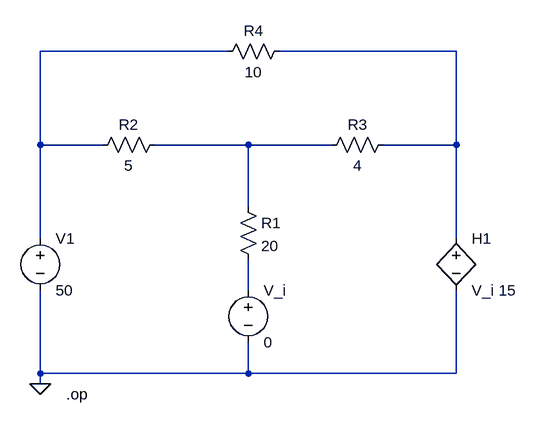
[diagram p0: schematic CH03-KP2-01.asc]
CH03-KP2-01.asc, the LTspice schematic file:
Version 4
SHEET 1 880 680
WIRE 192 112 -96 112
WIRE 544 112 272 112
WIRE -96 256 -96 112
WIRE 0 256 -96 256
WIRE 224 256 80 256
WIRE 352 256 224 256
WIRE 544 256 544 112
WIRE 544 256 432 256
WIRE 224 352 224 256
WIRE -96 400 -96 256
WIRE 544 400 544 256
WIRE 224 480 224 432
WIRE -96 608 -96 480
WIRE 224 608 224 560
WIRE 224 608 -96 608
WIRE 544 608 544 480
WIRE 544 608 224 608
WIRE -96 624 -96 608
FLAG -96 624 0
DATAFLAG 256 256 "$"
SYMBOL res 208 336 R0
SYMATTR InstName R1
SYMATTR Value 20
SYMBOL res 96 240 R90
WINDOW 0 0 56 VBottom 2
WINDOW 3 32 56 VTop 2
SYMATTR InstName R2
SYMATTR Value 5
SYMBOL res 448 240 R90
WINDOW 0 0 56 VBottom 2
WINDOW 3 32 56 VTop 2
SYMATTR InstName R3
SYMATTR Value 4
SYMBOL res 288 96 R90
WINDOW 0 0 56 VBottom 2
WINDOW 3 32 56 VTop 2
SYMATTR InstName R4
SYMATTR Value 10
SYMBOL voltage -96 384 R0
SYMATTR InstName V1
SYMATTR Value 50
SYMBOL voltage 224 464 R0
SYMATTR InstName V_i
SYMATTR Value 0
SYMBOL h 544 384 R0
SYMATTR InstName H1
SYMATTR Value V_i 15
TEXT -56 640 Left 2 !.op

The netlist it stands for:
* CH03-KP2-01.asc
R1 N003 N004 20
R2 N003 N001 5
R3 N002 N003 4
R4 N002 N001 10
V1 N001 0 50
V_i N004 0 0
H1 N002 0 V_i 15
.op
.backanno
.end